# EAGLE schematic MRCS-cpNode-ProMini v3.1a (EAGLE 7.7.0)
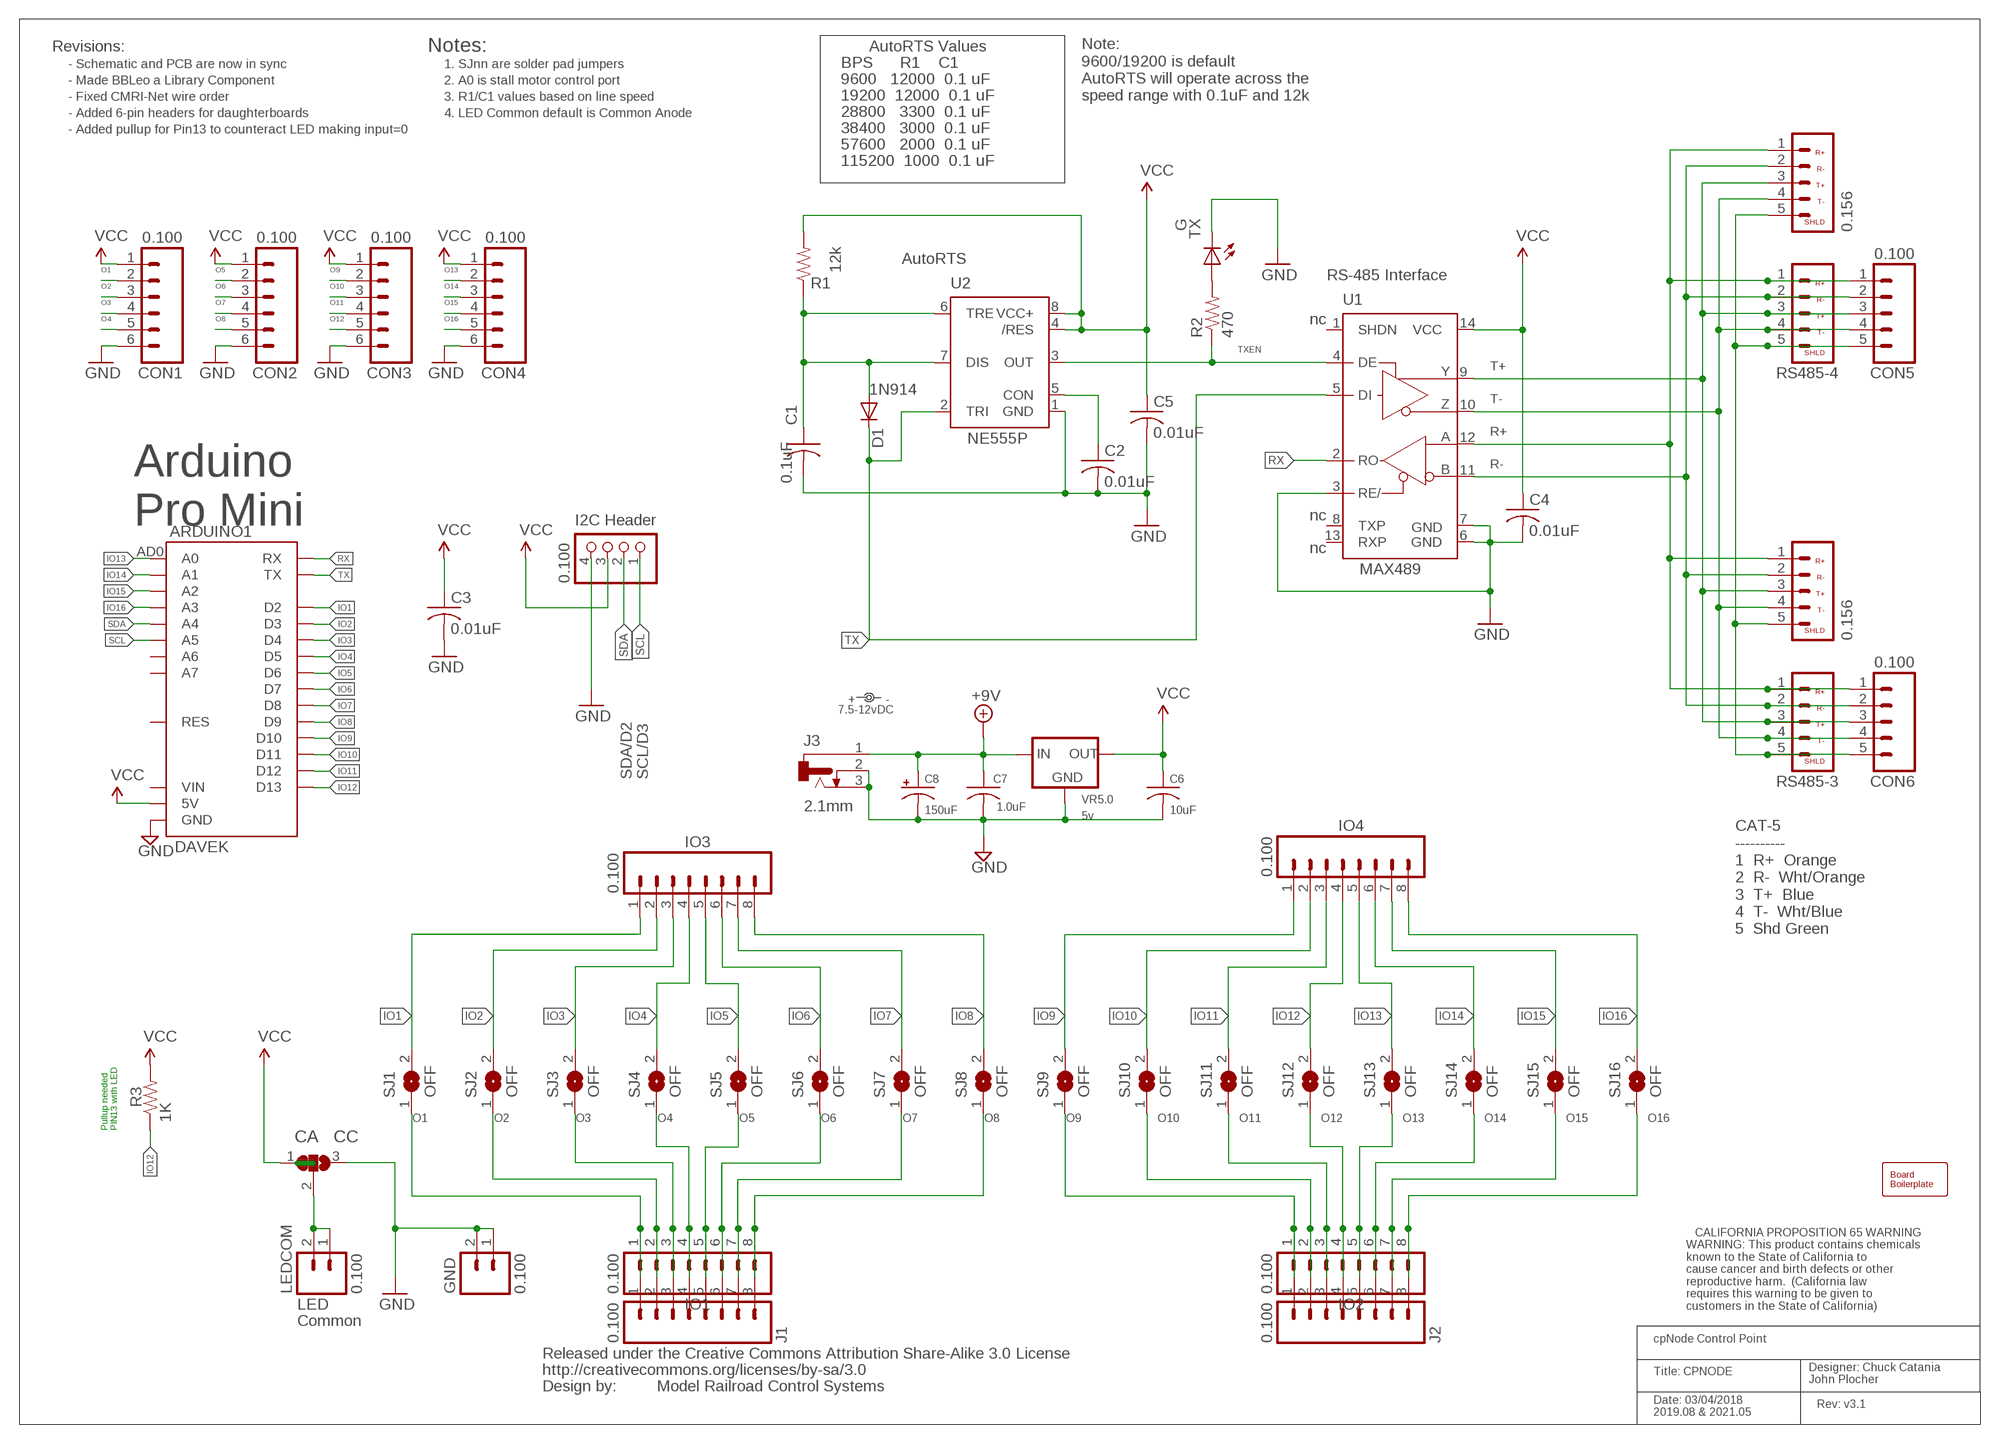
[diagram p0: schematic, sheet 1]

## Parts
ARDUINO1  DAVEK  ARDUINO-PRO-MINIDAVESROBOT  [ARDUINO_PRO_MINI_DAVEK]
BOARD1  BOARD  BOARD69X100MRCS  [BOARD-DINRAIL-2.71IN-MRCS]
C1  0.1uF  CAPPTH2  [C-PTH-0.100]
C2  0.01uF  CAPPTH2  [C-PTH-0.100]
C3  0.01uF  CAPPTH2  [C-PTH-0.100]
C4  0.01uF  CAPPTH2  [C-PTH-0.100]
C5  0.01uF  CAPPTH2  [C-PTH-0.100]
C6  10uF  CAPPTH1  [C050-024X044]
C7  1.0uF  CAPPTH1  [C050-024X044]
C8  150uF  CAP-POLPTH-5MM  [E5-10.5]
CON1  0.100  CONNECTOR-M06SIP_LOCK  [1X06-SIP_LOCK]
CON2  0.100  CONNECTOR-M06SIP_LOCK  [1X06-SIP_LOCK]
CON3  0.100  CONNECTOR-M06SIP_LOCK  [1X06-SIP_LOCK]
CON4  0.100  CONNECTOR-M06SIP_LOCK  [1X06-SIP_LOCK]
CON5  0.100  CONNECTOR-M05LOCK  [1X05_LOCK]
CON6  0.100  CONNECTOR-M05LOCK  [1X05_LOCK]
D1  1N4148  DIODE1N4148  [DIODE-1N4148]
GND  0.100  M02POLAR_LOCK  [MOLEX-1X2_LOCK]
I2CHDR  0.100  PINHD-1X4/90  [1X04/90]
IO1  0.100  M081X08  [1X08]
IO2  0.100  M081X08  [1X08]
IO3  0.100  M081X08  [1X08]
IO4  0.100  M081X08  [1X08]
J1  0.100  CONNECTOR-M08LOCK_LONGPADS  [1X08_LOCK_LONGPADS]
J2  0.100  CONNECTOR-M08LOCK_LONGPADS  [1X08_LOCK_LONGPADS]
J3  2.1mm  CONNECTOR-DC-POWER-RA  [DCJ0202]
LABEL1  7.5-12vDC  DOC-POWER_LABEL  [PWR_LABEL]
LEDCOM  0.100  M02POLAR_LOCK  [MOLEX-1X2_LOCK]
P1  CA CC  PAD-SOLDERJUMPER-2WAYT  [3P-SMD-2X4.8]
R1  12k  RPTH04  [AXIAL-0.4-RES]
R2  470  RPTH04  [AXIAL-0.4-RES]
R3  1K  RPTH04  [AXIAL-0.4-RES]
RS485-1  0.156  CONNECTOR-CMRINET.156  [KK-156-5]
RS485-2  0.156  CONNECTOR-CMRINET.156  [KK-156-5]
RS485-3  3.5mm  CONNECTOR-CMRINET3.5MM  [CMRINET-3.5MM]
RS485-4  3.5mm  CONNECTOR-CMRINET3.5MM  [CMRINET-3.5MM]
SJ1  OFF  SJ  [SJ]
SJ2  OFF  SJ  [SJ]
SJ3  OFF  SJ  [SJ]
SJ4  OFF  SJ  [SJ]
SJ5  OFF  SJ  [SJ]
SJ6  OFF  SJ  [SJ]
SJ7  OFF  SJ  [SJ]
SJ8  OFF  SJ  [SJ]
SJ9  OFF  SJ  [SJ]
SJ10  OFF  SJ  [SJ]
SJ11  OFF  SJ  [SJ]
SJ12  OFF  SJ  [SJ]
SJ13  OFF  SJ  [SJ]
SJ14  OFF  SJ  [SJ]
SJ15  OFF  SJ  [SJ]
SJ16  OFF  SJ  [SJ]
TX  G  LEDLED3MM  [LED3MM]
U1  MAX3465CPD  [DIL14]
U2  NE555P  [DIL-08]
U$1  CREATIVE_COMMONS  [CREATIVE_COMMONS]
U$2  Prop65  CA-PROP65WARNING  [CA-PROP65WARNING]
VR5.0  5v  VREG-PTH-RA-  [TO-220-RA]

## Nets
+9V [Feed]: C7.1 C8.+ J3.1 VR5.0.IN
GND: ARDUINO1.GND@1(GND) ARDUINO1.GND@2(GND) ARDUINO1.GND@4(GND) C1.2 C2.2 C3.2 C4.2 C5.2 C6.2 C7.2 C8.- CON1.6 CON2.6 CON3.6 CON4.6 GND.1 GND.2 I2CHDR.4 J3.2 J3.3 P1.3 TX.K(C) U1.3(RE/) U1.6(GND) U1.7(GND) U2.1(GND) VR5.0.GND
IO1: ARDUINO1.D2 IO3.1 SJ1.2
IO2: ARDUINO1.D3 IO3.2 SJ2.2
IO3: ARDUINO1.D4 IO3.3 SJ3.2
IO4: ARDUINO1.D5 IO3.4 SJ4.2
IO5: ARDUINO1.D6 IO3.5 SJ5.2
IO6: ARDUINO1.D7 IO3.6 SJ6.2
IO7: ARDUINO1.D8 IO3.7 SJ7.2
IO8: ARDUINO1.D9 IO3.8 SJ8.2
IO9: ARDUINO1.D10 IO4.1 SJ9.2
IO10: ARDUINO1.D11 IO4.2 SJ10.2
IO11: ARDUINO1.D12 IO4.3 SJ11.2
IO12: ARDUINO1.D13 IO4.4 R3.P$1 SJ12.2
IO13: ARDUINO1.AD0(A0) IO4.5 SJ13.2
IO14: ARDUINO1.AD1(A1) IO4.6 SJ14.2
IO15: ARDUINO1.AD2(A2) IO4.7 SJ15.2
IO16: ARDUINO1.AD3(A3) IO4.8 SJ16.2
N$29: R2.P$2 TX.A
N$38: C2.1 U2.5(CON)
N$45: LEDCOM.1 LEDCOM.2 P1.2
N$52: C1.1 D1.A R1.P$1 U2.6(TRE) U2.7(DIS)
O1: CON1.2 IO1.1 J1.1 SJ1.1
O2: CON1.3 IO1.2 J1.2 SJ2.1
O3: CON1.4 IO1.3 J1.3 SJ3.1
O4: CON1.5 IO1.4 J1.4 SJ4.1
O5: CON2.2 IO1.5 J1.5 SJ5.1
O6: CON2.3 IO1.6 J1.6 SJ6.1
O7: CON2.4 IO1.7 J1.7 SJ7.1
O8: CON2.5 IO1.8 J1.8 SJ8.1
O9: CON3.2 IO2.1 J2.1 SJ9.1
O10: CON3.3 IO2.2 J2.2 SJ10.1
O11: CON3.4 IO2.3 J2.3 SJ11.1
O12: CON3.5 IO2.4 J2.4 SJ12.1
O13: CON4.2 IO2.5 J2.5 SJ13.1
O14: CON4.3 IO2.6 J2.6 SJ14.1
O15: CON4.4 IO2.7 J2.7 SJ15.1
O16: CON4.5 IO2.8 J2.8 SJ16.1
R+: CON5.1 CON6.1 RS485-1.1 RS485-2.1 RS485-3.1 RS485-4.1 U1.12(A)
R-: CON5.2 CON6.2 RS485-1.2 RS485-2.2 RS485-3.2 RS485-4.2 U1.11(B)
RX: ARDUINO1.RX U1.2(RO)
SCL [signals]: ARDUINO1.AD5(A5) I2CHDR.1
SDA [signals]: ARDUINO1.AD4(A4) I2CHDR.2
SHIELD: CON5.5 CON6.5 RS485-1.5 RS485-2.5 RS485-3.5 RS485-4.5
T+: CON5.3 CON6.3 RS485-1.3 RS485-2.3 RS485-3.3 RS485-4.3 U1.9(Y)
T-: CON5.4 CON6.4 RS485-1.4 RS485-2.4 RS485-3.4 RS485-4.4 U1.10(Z)
TX: ARDUINO1.TX@1(TX) D1.C U1.5(DI) U2.2(TRI)
TXEN: R2.P$1 U1.4(DE) U2.3(OUT)
VCC: ARDUINO1.5V C3.1 C4.1 C5.1 C6.1 CON1.1 CON2.1 CON3.1 CON4.1 I2CHDR.3 P1.1 R1.P$2 R3.P$2 U1.14(VCC) U2.4(/RES) U2.8(VCC+) VR5.0.OUT
Unconnected: ARDUINO1.AD6(A6) ARDUINO1.AD7(A7) ARDUINO1.RES ARDUINO1.RES@1(RES) ARDUINO1.VIN U1.1(SHDN) U1.8(TXP) U1.13(RXP)

## Notes on the sheet
- Revisions: | Notes: | AutoRTS Values
- - Schematic and PCB are now in sync | 1. SJnn are solder pad jumpers | BPS      R1    C1
- - Made BBLeo a Library Component | 2. A0 is stall motor control port | 9600   12000  0.1 uF
- - Fixed CMRI-Net wire order | 3. R1/C1 values based on line speed | 19200  12000  0.1 uF
- Note: 
  9600/19200 is default
  AutoRTS will operate across the
  speed range with 0.1uF and 12k
- - Added 6-pin headers for daughterboards | 4. LED Common default is Common Anode | 28800   3300  0.1 uF
- - Added pullup for Pin13 to counteract LED making input=0 | 38400   3000  0.1 uF
- 57600   2000  0.1 uF
- 115200  1000  0.1 uF
- AutoRTS
- RS-485 Interface
- nc
- T+
- 1N914
- T-
- R+
- R-
- nc
- Arduino
  Pro Mini
- I2C Header
- nc
- MAX489
- SDA/D2 | SCL/D3
- CAT-5
  ----------
  1  R+  Orange
  2  R-  Wht/Orange
  3  T+  Blue
  4  T-  Wht/Blue
  5  Shd Green
- Pullup needed
  PIN13 with LED
- LED
- Common
- cpNode Control Point
- Title: CPNODE
- Designer: Chuck Catania
  John Plocher
- Model Railroad Control Systems
- Rev: v3.1
- Date: 03/04/2018
  2019.08 & 2021.05

## Library data of the parts
ARDUINO1 = SPCoast:ARDUINO-PRO-MINI
BOARD1 = SPCoast:BOARD
C1-C7 = SPCoast:CAP*
C8 = SPCoast:CAP-POL*
CON1-CON4 = SPCoast:CONNECTOR-M06: Header 6 Standard 6-pin 0.1" header
CON5 CON6 = SPCoast:CONNECTOR-M05: Header 5 Standard 5-pin 0.1" header. Use with straight break away headers (SKU : PRT-00116), right angle break away headers (PRT-00553), swiss pins (PRT-00743), machine pins (PRT-00117), and female headers (PRT-00115). Molex polarized connector foot print use with SKU : PRT-08230 with associated crimp pins and housings.
D1 = SPCoast:DIODE: Diode These are standard reverse protection diodes and small signal diodes. SMA package can handle up to about 1A. SOD-323 can handle about 200mA. What the SOD-323 package when ordering, there are some mfgs out there that are 5-pin packages.
GND LEDCOM = SparkFun:M02: Header 2 Standard 2-pin 0.1" header. Use with straight break away headers (SKU : PRT-00116), right angle break away headers (PRT-00553), swiss pins (PRT-00743), machine pins (PRT-00117), and female headers (PRT-00115). Molex polarized connector foot print use with SKU : PRT-08233 with associated crimp pins and housings.
I2CHDR = pinhead:PINHD-1X4: PIN HEADER
IO1-IO4 = SparkFun:M08: Header 8 Standard 8-pin 0.1" header. Use with straight break away headers (SKU : PRT-00116), right angle break away headers (PRT-00553), swiss pins (PRT-00743), machine pins (PRT-00117), and female headers (PRT-00115).
J1 J2 = SPCoast:CONNECTOR-M08: Header 8 Standard 8-pin 0.1" header. Use with straight break away headers (SKU : PRT-00116), right angle break away headers (PRT-00553), swiss pins (PRT-00743), machine pins (PRT-00117), and female headers (PRT-00115).
J3 = SPCoast:CONNECTOR-DC-POWER: DC POWER JACK
LABEL1 = SPCoast:DOC-POWER_LABEL
P1 = Discreter:PAD-SOLDERJUMPER-2WAY: Solder Jumper 2 way solder jumper
R1-R3 = SPCoast:R*: Resistor Basic schematic elements and footprints for 0603, 1206, and PTH 1/10th watt (small) resistors.
RS485-1-RS485-4 = SPCoast:CONNECTOR-CMRINET: CMRINet Top 3.5mm Screw Terminal 5 pos
SJ1-SJ16 = jumper:SJ: SMD solder JUMPER
TX = SPCoast:LED*
U1 = maxim:MAX346*: +5V, Fail-Safe, 40Mbps, Profibus RS-485/RS-422 Transceivers Source: MAX3465-MAX3469.pdf; MPN: MAX3465CPD+; OC_FARNELL: unknown; OC_NEWARK: 42M5444
U2 = SparkFun:NE555: General purpose bipolar Timer; MF: Arrow Electronics; MPN: NE555N; OC_FARNELL: 1467742; OC_NEWARK: 89K1486
U$1 = SparkFun:CREATIVE_COMMONS
U$2 = MRCS-prop65warningTop:CA-PROP65WARNING: CALIFORNIA PROPOSITION 65 WARNING
VR5.0 = SPCoast:VREG-?-*: Voltage Regulator Standard linear regulator. 7805 uses IGO pinout LM1117 uses GOI pinout

## Net classes
0 default: width 0.254 mm, drill 0.5 mm, clearance 0.203 mm
1 Power: width 0.254 mm, drill 0.8 mm, clearance 0.254 mm
2 signals: width 0.254 mm, drill 0.6 mm, clearance 0.254 mm
3 Feed: width 0.762 mm, drill 1.4 mm, clearance 0.254 mm